# Altium schematic sheet nfc-epd-power.SchDoc
size Letter
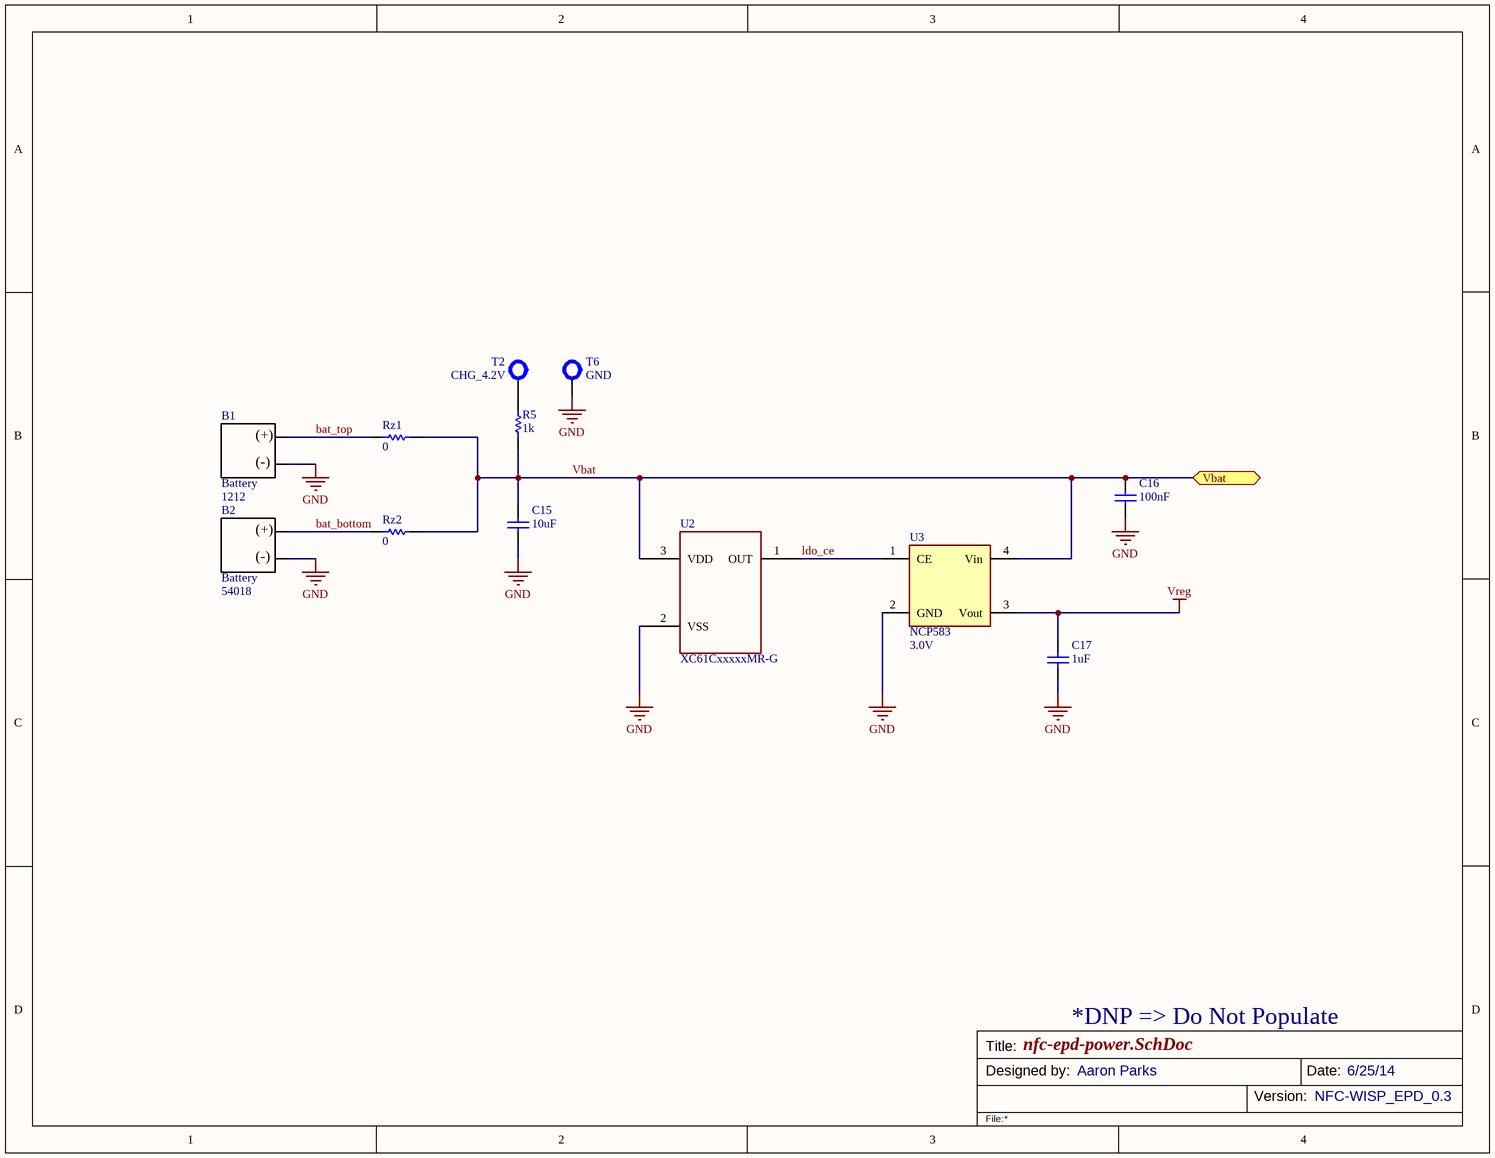
[diagram p0: nfc-epd-power.SchDoc]

## Parts
B1  Battery  Note: 1212  [PGEB0121212]
B2  Battery  Note: 54018  [PGEB0054018]
C15  value 10uF  [0603]  (hidden comment: Cap)
C16  value 100nF  [0402]  (hidden comment: Cap)
C17  value 1uF  [0402]  (hidden comment: Cap)
R5  value 1k  [0402]  (hidden comment: Res)
Rz1  value 0  [0402]  (hidden comment: Res)
Rz2  value 0  [0402]  (hidden comment: Res)
T2  Note: CHG_4.2V  [Test Point - Small]  (hidden comment: Test Point)
T6  Note: GND  [Test Point - Small]  (hidden comment: Test Point)
U2  XC61CxxxxxMR-G  [SOT23 - N]
U3  NCP583  value 3.0V  [SC82-AB]

## Ports
Vbat (bidir)

## Nets
GND: B1.1(BAT_NEG) B2.1(BAT_NEG) C15.1 C16.1 C17.1 T6.0 U2.2(VSS) U3.2(GND)
Vreg: C17.2 U3.3(Vout)
bat_bottom: B2.2(BAT_POS) Rz2.2
bat_top: B1.2(BAT_POS) Rz1.2
ldo_ce: U2.1(OUT) U3.1(CE)
Vbat: C15.2 C16.2 R5.1 Rz1.1 Rz2.1 U2.3(VDD) U3.4(Vin) ; port Vbat
NetR5_2: R5.2 T2.0

## Notes on the sheet
- *DNP => Do Not Populate
- Title:
- Designed by:
- Aaron Parks
- Version:
- Date:
- NFC-WISP_EPD_0.3
- 6/25/14
- File:
- (in symbol Powerstream_Battery) (+); (-)

## Library data of the parts
B1 B2 = Powerstream_Battery: Powerstream Lithium Battery
C15-C17 = Cap: Ceramic Capacitor (Surface Mount); Manufacturer: Generic Ceramic Chip Cap (TBD); Digi-Key Part Number: *; Manufacturer Part Number: *; Note: *; Rating: *
R5 Rz1 Rz2 = Res: Chip Resistor (Surface Mount); Manufacturer: Generic Chip Res (TBD); Manufacturer Part Number: *; Digi-Key Part Number: *; Rating: *; Note: *
T2 T6 = Test Point: Test Point, large or small foot prints; Manufacturer Part Number: Example: 5000, 5013; Manufacturer: Keystone Electronics; Digi-Key Part Number: Example: 5000K-ND, 5012K-ND, Surface mount 5015KCT-ND; Rating: *; Value: *
U2 = XC61CxxxxxMR-G: Torex IC Supervisor, SOT-23
U3 = NCP583: Regulator: Ultra-Low Iq 150mA CMOS LDO Regulator with Enable; Manufacturer: ON Semiconductor; Manufacturer Part Number: NCP583SQ18T1G; Digi-Key Part Number: NCP583SQ18T1GOSCT-ND; Rating: *; Note: *